# Altium schematic sheet power2.SchDoc
size A
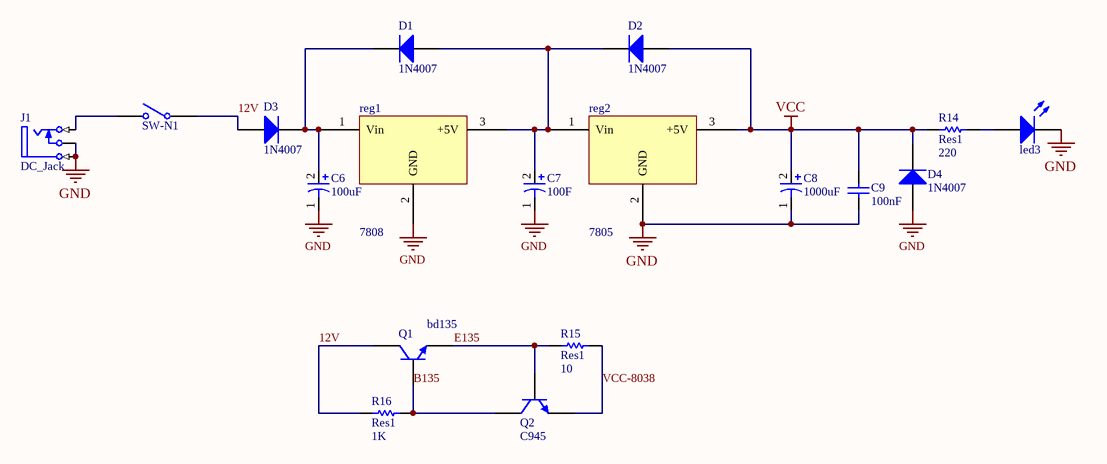
[diagram p0: power2.SchDoc]

## Parts
C6  value 100uF  [Cap-Polar-5.5mm]  (hidden comment: Cap-Polar)
C7  value 100F  [Cap-Polar-5.5mm]  (hidden comment: Cap-Polar)
C8  value 1000uF  [Cap-Polar-10.5mm]  (hidden comment: Cap-Polar)
C9  value 100nF  [My_cap100n]  (hidden comment: Cap-NF)
D1  1N4007  [DO-41]
D2  1N4007  [DO-41]
D3  1N4007  [DO-41]
D4  1N4007  [DO-41]
J1  DC_Jack  [Power Jack]
led3  LED 5mm  [LED-5mm]  (value not drawn)
Q1  bd135  [SOT-32]
Q2  C945  [C945]
R14  Res1  value 220  [AXIAL-0.3]
R15  Res1  value 10  [AXIAL-0.3]
R16  Res1  value 1K  [AXIAL-0.3]
reg1  7808  [REG-7805-smd]
reg2  7805  [REG-7805-smd]
SW-N1  Switch-1 way  [rocker - switch]  (value not drawn)

## Nets
GND: C6.1 C7.1 C8.1 C9.2 D4.A J1.2(TN) J1.3(S) led3.2(K) reg1.2(GND) reg2.2(GND)
VCC: C8.2 C9.1 D2.A D4.K R14.1 reg2.3(+5V)
12V: D3.A Q1.2(C) R16.1 SW-N1.1(COMMON)
B135: Q1.3(B) Q2.2(C) R16.2
E135: Q1.1(E) Q2.3(B) R15.1
VCC-8038: Q2.1(E) R15.2
NetC6_2: C6.2 D1.K D3.K reg1.1(Vin)
NetC7_2: C7.2 D1.A D2.K reg1.3(+5V) reg2.1(Vin)
NetJ1_1: J1.1(T) SW-N1.2(NO)
Netled3_1: led3.1(A) R14.2

## Library data of the parts
C6-C8 = Cap-Polar: Polarized Capacitor (Axial); Published: 8-Jun-2000; LatestRevisionDate: 17-Jul-2002; LatestRevisionNote: Re-released for DXP Platform.; PackageReference: POLAR0.8; Publisher: Altium Limited
C9 = Cap-NF: Capacitor; Published: 8-Jun-2000; LatestRevisionDate: 17-Jul-2002; LatestRevisionNote: Re-released for DXP Platform.; PackageReference: RAD-0.3; Publisher: Altium Limited
D1-D4 = 1N4007: 1 Amp Diode; pin to pad: A>1 K>2
J1 = DC_Jack: PackageDocument: 2003; PCB_Layout: Complies with manufacturer's recommendation.; DrillAndSlotSize: Corresponds to nominal value.; LatestRevisionDate: 15-Jul-2004; LatestRevisionNote: Component Replaced & renamed from "Phonejack".; DatasheetDocument: 2003; PackageReference: S1VS_SNB; Publisher: Altium Limited; ComponentLink1Description: Manufacturer Link; ComponentLink1URL: http://www.cliffuk.co.uk/
led3 = LED 5mm: Typical LED; Designer: Seyed Mohsen Ghasemian; Published: 07/31/2012; PackageReference: LED; Publisher: www.picpars.com; PackageDescription: LED; 2 Leads
Q1 = C945: NPN Transistor; pin to pad: 1>B 2>C 3>E; Designer: Saeid Jorablo; Company: IPA CO; Last Update Time: 2008/08/04; Value: bd135
Q2 = C945: NPN Transistor; Designer: Saeid Jorablo; Company: IPA CO; Last Update Time: 2008/08/04; Value: C945
R14-R16 = Res1: Resistor; Published: 8-Jun-2000; LatestRevisionDate: 17-Jul-2002; LatestRevisionNote: Re-released for DXP Platform.; PackageReference: AXIAL-0.3; Publisher: Altium Limited; PackageDescription: Axial Device, Thru-Hole; 2 Leads; 0.3 in Pin Spacing
reg1 reg2 = 7805: Regulator